# Altium schematic sheet IRLR8726TRPBF1_IRLR8726TRPBF.schdoc
size 127 x 101 mm
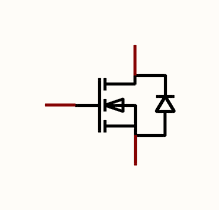
[diagram p0: IRLR8726TRPBF1_IRLR8726TRPBF.schdoc]

## Parts
Q?  IRLR8726TRPBF  [TO-252-2_L6.6-W6.1-P4.58-LS9.9-TL]  (value not drawn)

## Nets

Not connected (* = marked no-connect by the designer): Q? 1(G) 2(D) 3(S)

## Library data of the parts
Q? = IRLR8726TRPBF: Manufacturer: Infineon(英飞凌); Add into BOM: yes; Type: 1个N沟道; Drain Source Voltage (Vdss): 30V; Continuous Drain Current (Id): 86A; Power Dissipation (Pd): 75W; Drain Source On Resistance (RDS(on)@Vgs,Id): 5.8mΩ@10V,25A; Gate Threshold Voltage (Vgs(th)@Id): 2.35V@50uA; Total Gate Charge (Qg@Vgs): 23nC@4.5V; Input Capacitance (Ciss@Vds): 2.15nF@15V; Symbol: IRLR8726TRPBF; Device: IRLR8726TRPBF; LCSC Part Name: 1个N沟道 耐压:30V 电流:86A; Supplier Part: C81137; Manufacturer Part: IRLR8726TRPBF; Supplier Footprint: TO-252-2(DPAK); JLCPCB Part Class: Extended Part; Datasheet: https://atta.szlcsc.com/upload/public/pdf/source/20170518/1495085732211.pdf; Supplier: LCSC; Convert to PCB: yes; Operating Temperature: -55℃~+175℃@(Tj)